# EAGLE schematic Magic Key (EAGLE 7.1.0)
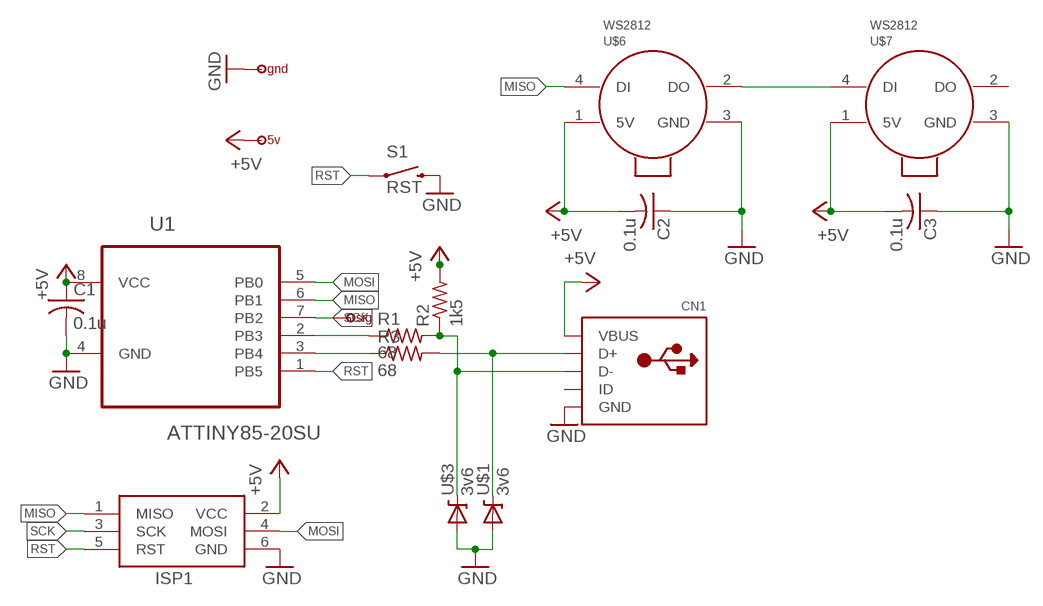
[diagram p0: schematic, sheet 1]

## Parts
C1  0.1u  C-USC0603  [C0603]
C2  0.1u  C-USC0603  [C0603]
C3  0.1u  C-USC0603  [C0603]
CN1  USB_LEGS  [MICRO_USB_LEGS]
ISP1  AVRISP-6  [AVRISP]
R1  68  R-US_R0603  [R0603]
R2  1k5  R-US_R0603  [R0603]
R3  68  R-US_R0603  [R0603]
S1  RST  SWITCH-MOMENTARY-2SMD  [TACTILE-SWITCH-SMD]
U1  ATTINY85-20SU  [SOIC127P798X216-8N]
U$1  3v6  DIODE-ZENER-BZT52  [SOD-323]
U$2  gnd  1PINBIG  [1PIN]
U$3  3v6  DIODE-ZENER-BZT52  [SOD-323]
U$4  sig  1PINBIG  [1PIN]
U$5  5v  1PINBIG  [1PIN]
U$6  WS2812  [WS2812]
U$7  WS2812  [WS2812]

## Nets
+5V: C1.1 C2.2 C3.2 CN1.5(VBUS) ISP1.2(VCC) R2.2 U1.8(VCC) U$5.P$1(>NAME) U$6.1(5V) U$7.1(5V)
GND: C1.2 C2.1 C3.1 CN1.1(GND) ISP1.6(GND) S1.3 U1.4(GND) U$1.2(A) U$2.P$1(>NAME) U$3.2(A) U$6.3(GND) U$7.3(GND)
MISO: ISP1.1(MISO) U1.6(PB1) U$6.4(DI)
MOSI: ISP1.4(MOSI) U1.5(PB0)
N$1: CN1.4(D-) R1.2 R2.1 U$3.1(C)
N$2: CN1.3(D+) R3.2 U$1.1(C)
N$3: R1.1 U1.2(PB3)
N$4: R3.1 U1.3(PB4)
N$6: U$6.2(DO) U$7.4(DI)
RST: ISP1.5(RST) S1.1 U1.1(PB5)
SCK: ISP1.3(SCK) U1.7(PB2) U$4.P$1(>NAME)
Unconnected: CN1.2(ID) U$7.2(DO)

## Library data of the parts
C1-C3 = adafruit:C-US: CAPACITOR, American symbol
CN1 = OSH_Lab:USB: USB Connectors USBMINIB - Surface Mount Female Mini-B USB Connector 4UConnector: 06564 By microbuilder.eu Thru-hole RA Female Mini-B USB Connector 4UConnector: 18732 By ladyada.net
ISP1 = adafruit:AVRISP: AVR ISP HEADER Standard 6 pin header for AVR programming
R1-R3 = adafruit:R-US_: RESISTOR, American symbol
S1 = OSH_Lab:SWITCH-MOMENTARY-2: Various NO switches- pushbuttons, reed, etc; PROD_ID: SWCH-08247
U1 = Atmel_By_element14_Batch_1-00:ATTINY85-20SU: 8-bit Microcontroller with In-System Programmable Flash; MPN: ATTINY85-20SU; OC_FARNELL: 1455164; OC_NEWARK: 58M3797; PACKAGE: SOIC-8; SUPPLIER: Atmel
U$1 U$3 = SparkFun-DiscreteSemi:DIODE-ZENER: Zener Diode Production Part - 8199 3.4V Zener Voltage
U$2 U$4 U$5 = OSH_Lab:1PIN: Pin
U$6 U$7 = OSH_Lab:WS2812: WS2812 RGB LED Neopixel